# EAGLE design SpinningControls (EAGLE 9.5.2)

## Sheet 1 of 2
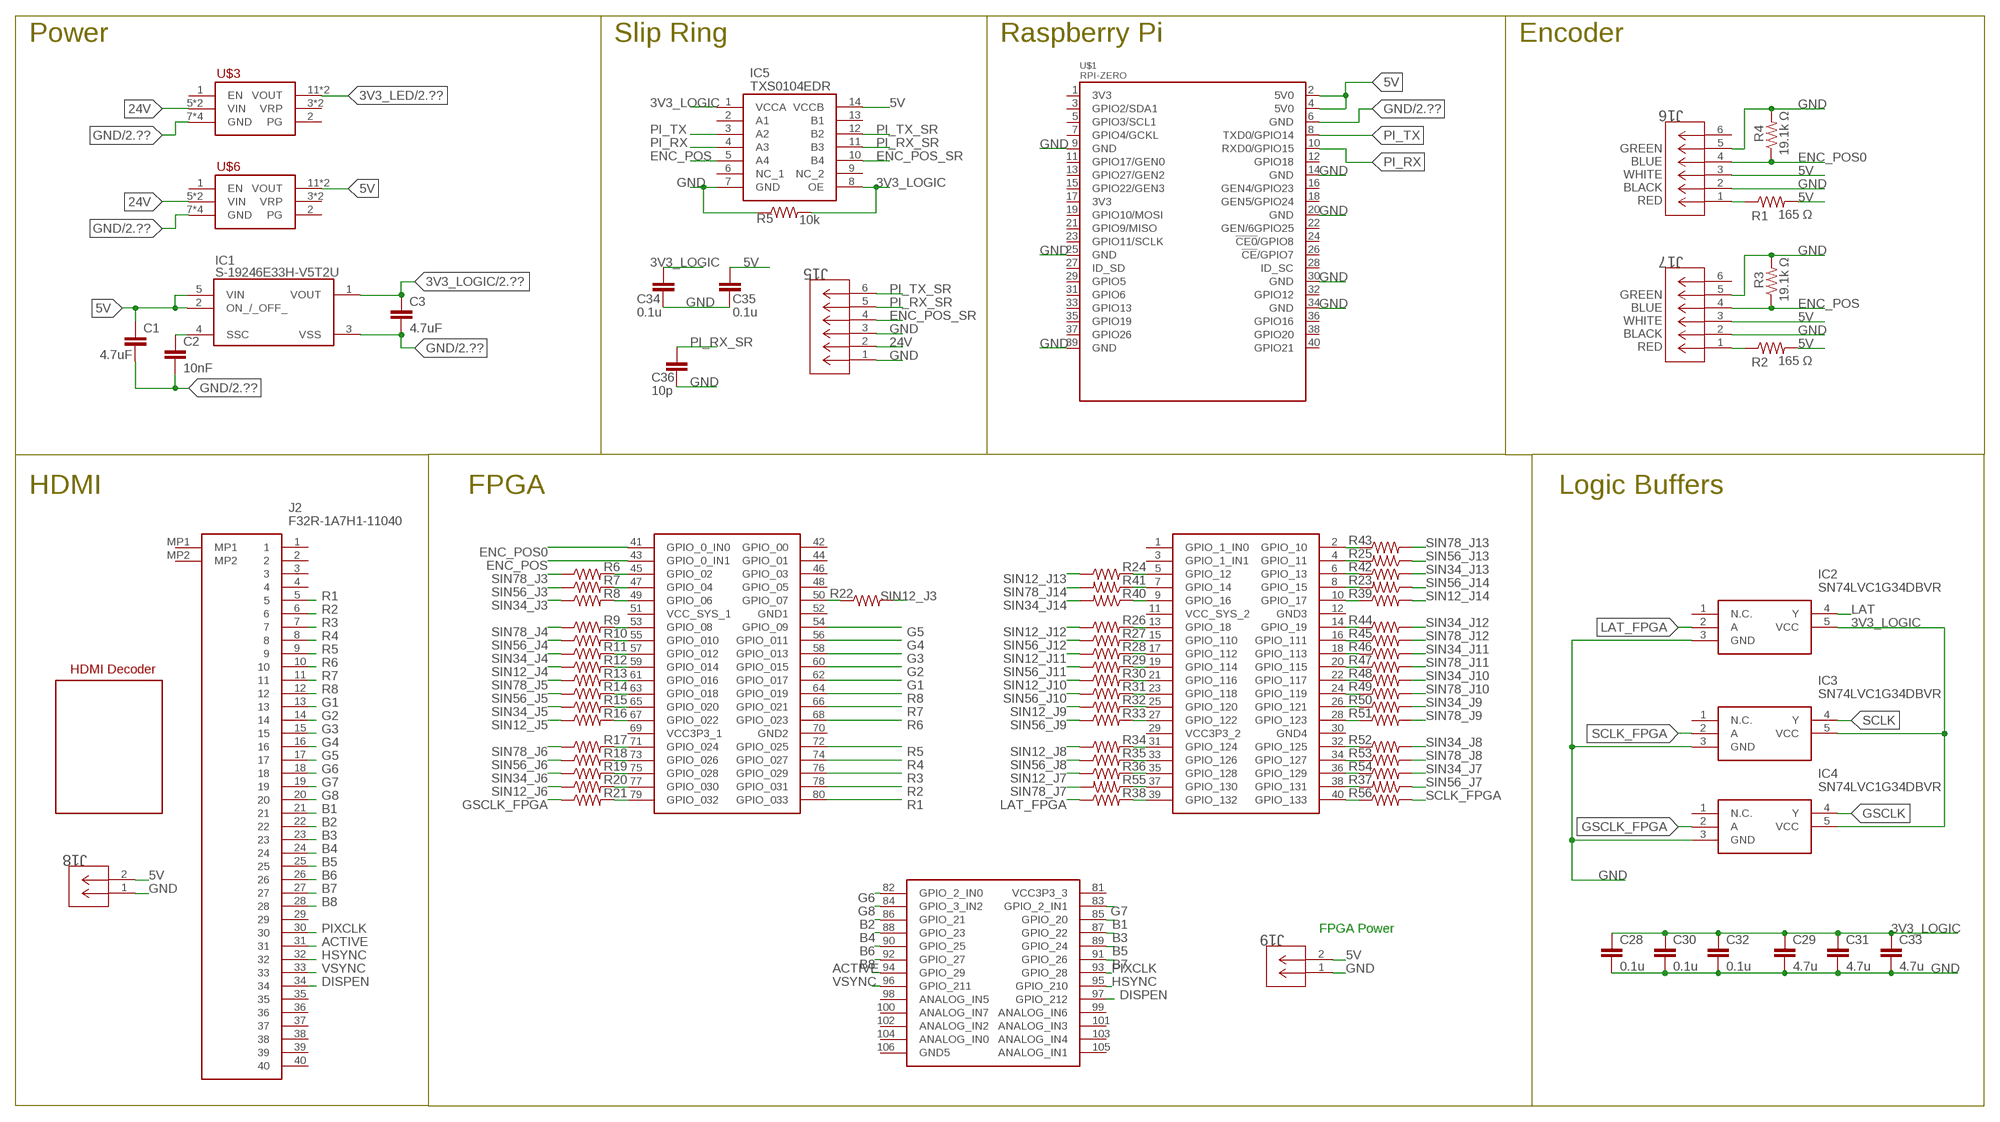
[diagram p0: schematic, sheet 1]

### Parts
C1  4.7uF  C-EUC0603  [C0603]
C2  10nF  C-EUC0603  [C0603]
C3  4.7uF  C-EUC0603  [C0603]
C28  0.1u  CAP_SMDC0603  [C0603]
C29  4.7u  CAP_SMDC0603  [C0603]
C30  0.1u  CAP_SMDC0603  [C0603]
C31  4.7u  CAP_SMDC0603  [C0603]
C32  0.1u  CAP_SMDC0603  [C0603]
C33  4.7u  CAP_SMDC0603  [C0603]
C34  0.1u  CAP_SMDC0603  [C0603]
C35  0.1u  CAP_SMDC0603  [C0603]
C36  10p  C-EUC0603  [C0603]
FPGA  DE0-NANO  [DE0-NANO]
IC1  S-19246E33H-V5T2U  [S19246E33HV5T2U]
IC2  SN74LVC1G34DBVR  [SOT95P280X145-5N]
IC3  SN74LVC1G34DBVR  [SOT95P280X145-5N]
IC4  SN74LVC1G34DBVR  [SOT95P280X145-5N]
IC5  TXS0104EDR  [SOIC127P600X175-14N]
J2  F32R-1A7H1-11040  [F32R1A7H111040]
J15  430450612  [CON_430450612_MOL]
J16  430450612  [CON_430450612_MOL]
J17  430450612  [CON_430450612_MOL]
J18  436500215  [CON_436500215_MOL]
J19  436500215  [CON_436500215_MOL]
R1  165 Ω  R-US_R0603  [R0603]
R2  165 Ω  R-US_R0603  [R0603]
R3  19.1k Ω  R-US_R0603  [R0603]
R4  19.1k Ω  R-US_R0603  [R0603]
R5  10k  R-US_R0603  [R0603]
R6  R-US_R0402  [R0402]
R7  R-US_R0402  [R0402]
R8  R-US_R0402  [R0402]
R9  R-US_R0402  [R0402]
R10  R-US_R0402  [R0402]
R11  R-US_R0402  [R0402]
R12  R-US_R0402  [R0402]
R13  R-US_R0402  [R0402]
R14  R-US_R0402  [R0402]
R15  R-US_R0402  [R0402]
R16  R-US_R0402  [R0402]
R17  R-US_R0402  [R0402]
R18  R-US_R0402  [R0402]
R19  R-US_R0402  [R0402]
R20  R-US_R0402  [R0402]
R21  R-US_R0402  [R0402]
R22  R-US_R0402  [R0402]
R23  R-US_R0402  [R0402]
R24  R-US_R0402  [R0402]
R25  R-US_R0402  [R0402]
R26  R-US_R0402  [R0402]
R27  R-US_R0402  [R0402]
R28  R-US_R0402  [R0402]
R29  R-US_R0402  [R0402]
R30  R-US_R0402  [R0402]
R31  R-US_R0402  [R0402]
R32  R-US_R0402  [R0402]
R33  R-US_R0402  [R0402]
R34  R-US_R0402  [R0402]
R35  R-US_R0402  [R0402]
R36  R-US_R0402  [R0402]
R37  R-US_R0402  [R0402]
R38  R-US_R0402  [R0402]
R39  R-US_R0402  [R0402]
R40  R-US_R0402  [R0402]
R41  R-US_R0402  [R0402]
R42  R-US_R0402  [R0402]
R43  R-US_R0402  [R0402]
R44  R-US_R0402  [R0402]
R45  R-US_R0402  [R0402]
R46  R-US_R0402  [R0402]
R47  R-US_R0402  [R0402]
R48  R-US_R0402  [R0402]
R49  R-US_R0402  [R0402]
R50  R-US_R0402  [R0402]
R51  R-US_R0402  [R0402]
R52  R-US_R0402  [R0402]
R53  R-US_R0402  [R0402]
R54  R-US_R0402  [R0402]
R55  R-US_R0402  [R0402]
R56  R-US_R0402  [R0402]
U$1  RPI-ZERO  [RASPBERRYPI_BASTELSTUBE_V13_RASPI_BOARD_B+_FULL]
U$2  TFP401  [TFP401]
U$3  3V3_BUCK_REGULATOR  [2X06]
U$6  5V_BUCK_REGULATOR  [2X06]

### Nets
3V3_LED: U$3.11(VOUT) U$3.12(VOUT) ; also sheet 2
3V3_LOGIC: C3.1 C28.1 C29.1 C30.1 C31.1 C32.1 C33.1 C34.1 IC1.1(VOUT) IC2.5(VCC) IC3.5(VCC) IC4.5(VCC) IC5.1(VCCA) IC5.8(OE) R5.2 ; also sheet 2
5V: C1.1 C35.1 IC1.2(ON_/_OFF_) IC1.5(VIN) IC5.14(VCCB) J16.3 J17.3 J18.2 J19.2 R1.2 R2.2 U$1.2(5V0) U$1.4(5V0) U$6.11(VOUT) U$6.12(VOUT)
24V: J15.2 U$3.5(VIN) U$3.6(VIN) U$6.5(VIN) U$6.6(VIN)
ACTIVE: FPGA.94(GPIO_29) J2.31
B1: FPGA.85(GPIO_20) J2.21
B2: FPGA.86(GPIO_21) J2.22
B3: FPGA.87(GPIO_22) J2.23
B4: FPGA.88(GPIO_23) J2.24
B5: FPGA.89(GPIO_24) J2.25
B6: FPGA.90(GPIO_25) J2.26
B7: FPGA.91(GPIO_26) J2.27
B8: FPGA.92(GPIO_27) J2.28
DISPEN: FPGA.97(GPIO_212) J2.34
ENC_POS: FPGA.43(GPIO_0_IN1) IC5.5(A4) J17.4 R3.1
ENC_POS0: FPGA.41(GPIO_0_IN0) J16.4 R4.1
ENC_POS_SR: IC5.10(B4) J15.4
G1: FPGA.62(GPIO_017) J2.13
G2: FPGA.60(GPIO_015) J2.14
G3: FPGA.58(GPIO_013) J2.15
G4: FPGA.56(GPIO_011) J2.16
G5: FPGA.54(GPIO_09) J2.17
G6: FPGA.82(GPIO_2_IN0) J2.18
G7: FPGA.83(GPIO_2_IN1) J2.19
G8: FPGA.84(GPIO_3_IN2) J2.20
GND: C1.2 C2.2 C3.2 C28.2 C29.2 C30.2 C31.2 C32.2 C33.2 C34.2 C35.2 C36.2 IC1.3(VSS) IC2.3(GND) IC3.3(GND) IC4.3(GND) IC5.7(GND) J15.1 J15.3 J16.2 J16.5 J17.2 J17.5 J18.1 J19.1 R3.2 R4.2 R5.1 U$1.6(GND) U$1.9(GND) U$1.14(GND) U$1.20(GND) U$1.25(GND) U$1.30(GND) U$1.34(GND) U$1.39(GND) U$3.7(GND) U$3.8(GND) U$3.9(GND) U$3.10(GND) U$6.7(GND) U$6.8(GND) U$6.9(GND) U$6.10(GND) ; also sheet 2
GSCLK: IC4.4(Y) ; also sheet 2
GSCLK_FPGA: IC4.2(A) R21.1
HSYNC: FPGA.95(GPIO_210) J2.32
LAT: IC2.4(Y) ; also sheet 2
LAT_FPGA: IC2.2(A) R38.1
N$1: J16.1 R1.1
N$2: FPGA.45(GPIO_02) R6.2
N$3: FPGA.50(GPIO_07) R22.1
N$4: C2.1 IC1.4(SSC)
N$5: FPGA.79(GPIO_032) R21.2
N$6: J17.1 R2.1
N$7: FPGA.8(GPIO_15) R23.2
N$8: FPGA.5(GPIO_12) R24.2
N$9: FPGA.4(GPIO_11) R25.2
N$10: FPGA.9(GPIO_16) R40.1
N$11: FPGA.7(GPIO_14) R41.1
N$12: FPGA.6(GPIO_13) R42.1
N$13: FPGA.2(GPIO_10) R43.1
N$14: FPGA.13(GPIO_18) R26.2
N$15: FPGA.47(GPIO_04) R7.2
N$16: FPGA.49(GPIO_06) R8.2
N$17: FPGA.15(GPIO_110) R27.2
N$18: FPGA.53(GPIO_08) R9.2
N$19: FPGA.55(GPIO_010) R10.2
N$20: FPGA.57(GPIO_012) R11.2
N$21: FPGA.59(GPIO_014) R12.2
N$22: FPGA.61(GPIO_016) R13.2
N$23: FPGA.63(GPIO_018) R14.2
N$24: FPGA.65(GPIO_020) R15.2
N$25: FPGA.67(GPIO_022) R16.2
N$26: FPGA.17(GPIO_112) R28.2
N$27: FPGA.71(GPIO_024) R17.2
N$28: FPGA.73(GPIO_026) R18.2
N$29: FPGA.75(GPIO_028) R19.2
N$30: FPGA.77(GPIO_030) R20.2
N$31: FPGA.19(GPIO_114) R29.2
N$32: FPGA.21(GPIO_116) R30.2
N$33: FPGA.23(GPIO_118) R31.2
N$34: FPGA.25(GPIO_120) R32.2
N$35: FPGA.27(GPIO_122) R33.2
N$36: FPGA.31(GPIO_124) R34.2
N$37: FPGA.33(GPIO_126) R35.2
N$38: FPGA.35(GPIO_128) R36.2
N$39: FPGA.38(GPIO_131) R37.2
N$40: FPGA.39(GPIO_132) R38.2
N$41: FPGA.14(GPIO_19) R44.1
N$42: FPGA.16(GPIO_111) R45.1
N$43: FPGA.18(GPIO_113) R46.1
N$44: FPGA.20(GPIO_115) R47.1
N$45: FPGA.22(GPIO_117) R48.1
N$46: FPGA.24(GPIO_119) R49.1
N$47: FPGA.26(GPIO_121) R50.1
N$48: FPGA.28(GPIO_123) R51.1
N$49: FPGA.32(GPIO_125) R52.1
N$50: FPGA.34(GPIO_127) R53.1
N$51: FPGA.36(GPIO_129) R54.1
N$52: FPGA.37(GPIO_130) R55.1
N$53: FPGA.40(GPIO_133) R56.1
N$54: FPGA.10(GPIO_17) R39.1
PI_RX: IC5.4(A3) U$1.10(RXD0/GPIO15)
PI_RX_SR: C36.1 IC5.11(B3) J15.5
PI_TX: IC5.3(A2) U$1.8(TXD0/GPIO14)
PI_TX_SR: IC5.12(B2) J15.6
PIXCLK: FPGA.93(GPIO_28) J2.30
R1: FPGA.80(GPIO_033) J2.5
R2: FPGA.78(GPIO_031) J2.6
R3: FPGA.76(GPIO_029) J2.7
R4: FPGA.74(GPIO_027) J2.8
R5: FPGA.72(GPIO_025) J2.9
R6: FPGA.68(GPIO_023) J2.10
R7: FPGA.66(GPIO_021) J2.11
R8: FPGA.64(GPIO_019) J2.12
SCLK: IC3.4(Y) ; also sheet 2
SCLK_FPGA: IC3.2(A) R56.2
SIN12_J3: R22.2 ; also sheet 2
SIN12_J4: R12.1 ; also sheet 2
SIN12_J5: R16.1 ; also sheet 2
SIN12_J6: R20.1 ; also sheet 2
SIN12_J7: R36.1 ; also sheet 2
SIN12_J8: R34.1 ; also sheet 2
SIN12_J9: R32.1 ; also sheet 2
SIN12_J10: R30.1 ; also sheet 2
SIN12_J11: R28.1 ; also sheet 2
SIN12_J12: R26.1 ; also sheet 2
SIN12_J13: R24.1 ; also sheet 2
SIN12_J14: R39.2 ; also sheet 2
SIN34_J3: R8.1 ; also sheet 2
SIN34_J4: R11.1 ; also sheet 2
SIN34_J5: R15.1 ; also sheet 2
SIN34_J6: R19.1 ; also sheet 2
SIN34_J7: R54.2 ; also sheet 2
SIN34_J8: R52.2 ; also sheet 2
SIN34_J9: R50.2 ; also sheet 2
SIN34_J10: R48.2 ; also sheet 2
SIN34_J11: R46.2 ; also sheet 2
SIN34_J12: R44.2 ; also sheet 2
SIN34_J13: R42.2 ; also sheet 2
SIN34_J14: R40.2 ; also sheet 2
SIN56_J3: R7.1 ; also sheet 2
SIN56_J4: R10.1 ; also sheet 2
SIN56_J5: R14.1 ; also sheet 2
SIN56_J6: R18.1 ; also sheet 2
SIN56_J7: R37.1 ; also sheet 2
SIN56_J8: R35.1 ; also sheet 2
SIN56_J9: R33.1 ; also sheet 2
SIN56_J10: R31.1 ; also sheet 2
SIN56_J11: R29.1 ; also sheet 2
SIN56_J12: R27.1 ; also sheet 2
SIN56_J13: R25.1 ; also sheet 2
SIN56_J14: R23.1 ; also sheet 2
SIN78_J3: R6.1 ; also sheet 2
SIN78_J4: R9.1 ; also sheet 2
SIN78_J5: R13.1 ; also sheet 2
SIN78_J6: R17.1 ; also sheet 2
SIN78_J7: R55.2 ; also sheet 2
SIN78_J8: R53.2 ; also sheet 2
SIN78_J9: R51.2 ; also sheet 2
SIN78_J10: R49.2 ; also sheet 2
SIN78_J11: R47.2 ; also sheet 2
SIN78_J12: R45.2 ; also sheet 2
SIN78_J13: R43.2 ; also sheet 2
SIN78_J14: R41.2 ; also sheet 2
VSYNC: FPGA.96(GPIO_211) J2.33
Unconnected: FPGA.1(GPIO_1_IN0) FPGA.3(GPIO_1_IN1) FPGA.11(VCC_SYS_2) FPGA.12(GND3) FPGA.29(VCC3P3_2) FPGA.30(GND4) FPGA.42(GPIO_00) FPGA.44(GPIO_01) FPGA.46(GPIO_03) FPGA.48(GPIO_05) FPGA.51(VCC_SYS_1) FPGA.52(GND1) FPGA.69(VCC3P3_1) FPGA.70(GND2) FPGA.81(VCC3P3_3) FPGA.98(ANALOG_IN5) FPGA.99(ANALOG_IN6) FPGA.100(ANALOG_IN7) FPGA.101(ANALOG_IN3) FPGA.102(ANALOG_IN2) FPGA.103(ANALOG_IN4) FPGA.104(ANALOG_IN0) FPGA.105(ANALOG_IN1) FPGA.106(GND5) IC2.1(N.C.) IC3.1(N.C.) IC4.1(N.C.) IC5.2(A1) IC5.6(NC_1) IC5.9(NC_2) IC5.13(B1) J2.1 J2.2 J2.3 J2.4 J2.29 J2.35 J2.36 J2.37 J2.38 J2.39 J2.40 J2.MP1 J2.MP2 J16.6 J17.6 U$1.1(3V3) U$1.3(GPIO2/SDA1) U$1.5(GPIO3/SCL1) U$1.7(GPIO4/GCKL) U$1.11(GPIO17/GEN0) U$1.12(GPIO18) U$1.13(GPIO27/GEN2) U$1.15(GPIO22/GEN3) U$1.16(GEN4/GPIO23) U$1.17(3V3) U$1.18(GEN5/GPIO24) U$1.19(GPIO10/MOSI) U$1.21(GPIO9/MISO) U$1.22(GEN/6GPIO25) U$1.23(GPIO11/SCLK) U$1.24(!CE0!/GPIO8) U$1.26(!CE!/GPIO7) U$1.27(ID_SD) U$1.28(ID_SC) U$1.29(GPIO5) U$1.31(GPIO6) U$1.32(GPIO12) U$1.33(GPIO13) U$1.35(GPIO19) U$1.36(GPIO16) U$1.37(GPIO26) U$1.38(GPIO20) U$1.40(GPIO21) U$3.1(EN) U$3.2(PG) U$3.3(VRP) U$3.4(VRP) U$6.1(EN) U$6.2(PG) U$6.3(VRP) U$6.4(VRP)

### Notes on the sheet
- Power | Slip Ring | Raspberry Pi | Encoder
- GREEN
  BLUE
  WHITE
  BLACK
  RED
- GREEN
  BLUE
  WHITE
  BLACK
  RED
- HDMI | FPGA | Logic Buffers
- FPGA Power

## Sheet 2 of 2
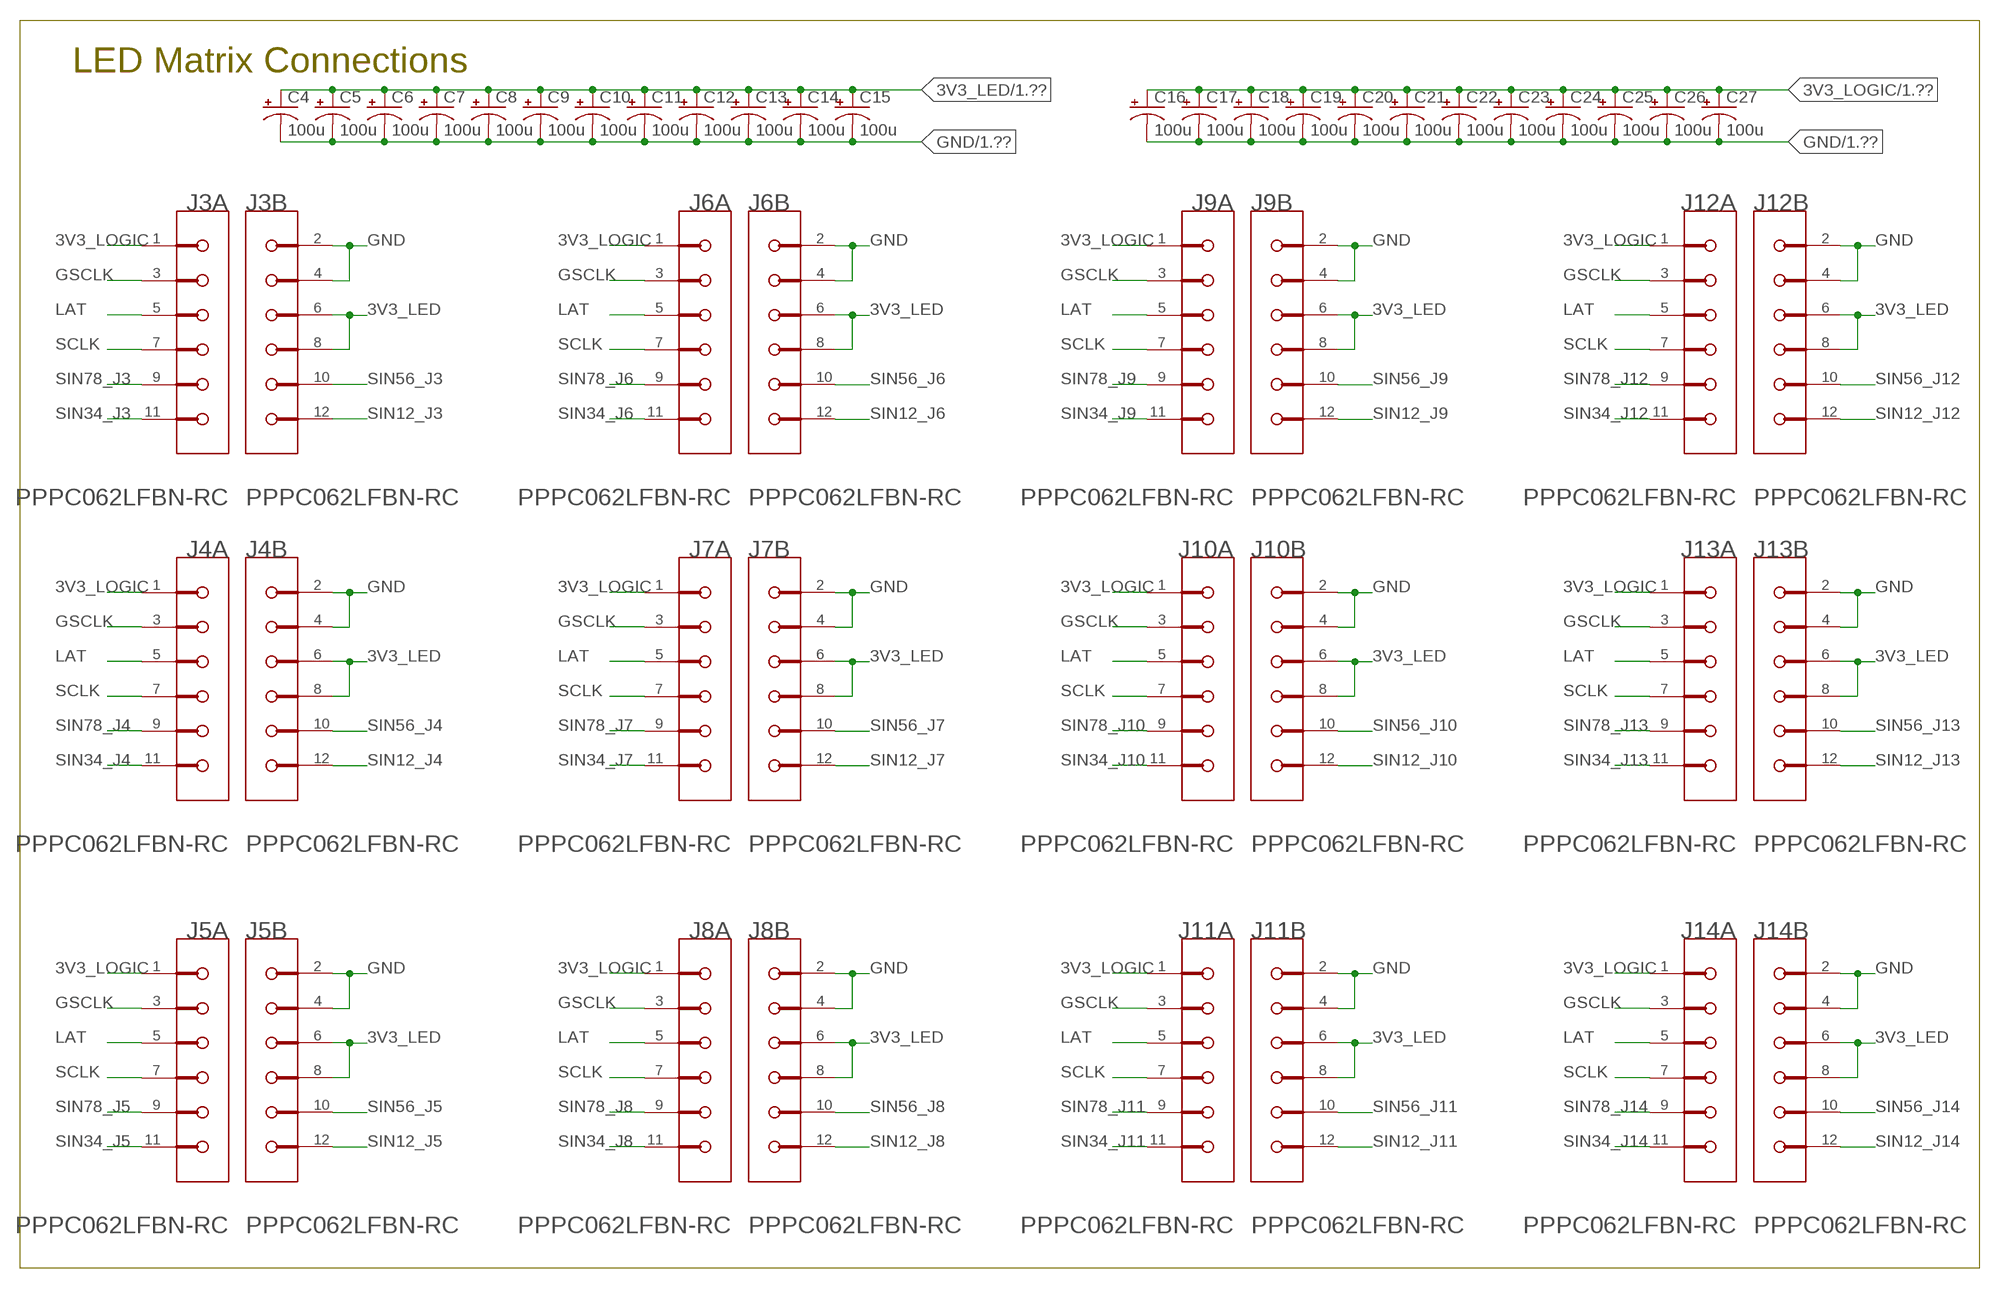
[diagram p1: schematic, sheet 2]

### Parts
C4  100u  CAP_THTE2-5  [E2-5]
C5  100u  CAP_THTE2-5  [E2-5]
C6  100u  CAP_THTE2-5  [E2-5]
C7  100u  CAP_THTE2-5  [E2-5]
C8  100u  CAP_THTE2-5  [E2-5]
C9  100u  CAP_THTE2-5  [E2-5]
C10  100u  CAP_THTE2-5  [E2-5]
C11  100u  CAP_THTE2-5  [E2-5]
C12  100u  CAP_THTE2-5  [E2-5]
C13  100u  CAP_THTE2-5  [E2-5]
C14  100u  CAP_THTE2-5  [E2-5]
C15  100u  CAP_THTE2-5  [E2-5]
C16  100u  CAP_THTE2-5  [E2-5]
C17  100u  CAP_THTE2-5  [E2-5]
C18  100u  CAP_THTE2-5  [E2-5]
C19  100u  CAP_THTE2-5  [E2-5]
C20  100u  CAP_THTE2-5  [E2-5]
C21  100u  CAP_THTE2-5  [E2-5]
C22  100u  CAP_THTE2-5  [E2-5]
C23  100u  CAP_THTE2-5  [E2-5]
C24  100u  CAP_THTE2-5  [E2-5]
C25  100u  CAP_THTE2-5  [E2-5]
C26  100u  CAP_THTE2-5  [E2-5]
C27  100u  CAP_THTE2-5  [E2-5]
J3  SULLINS_PPPC062LFBN-RCSULLINS_PPPC062LFBN-RC_0_0  [SULLINS_PPPC062LFBN-RC_0]
J4  SULLINS_PPPC062LFBN-RCSULLINS_PPPC062LFBN-RC_0_0  [SULLINS_PPPC062LFBN-RC_0]
J5  SULLINS_PPPC062LFBN-RCSULLINS_PPPC062LFBN-RC_0_0  [SULLINS_PPPC062LFBN-RC_0]
J6  SULLINS_PPPC062LFBN-RCSULLINS_PPPC062LFBN-RC_0_0  [SULLINS_PPPC062LFBN-RC_0]
J7  SULLINS_PPPC062LFBN-RCSULLINS_PPPC062LFBN-RC_0_0  [SULLINS_PPPC062LFBN-RC_0]
J8  SULLINS_PPPC062LFBN-RCSULLINS_PPPC062LFBN-RC_0_0  [SULLINS_PPPC062LFBN-RC_0]
J9  SULLINS_PPPC062LFBN-RCSULLINS_PPPC062LFBN-RC_0_0  [SULLINS_PPPC062LFBN-RC_0]
J10  SULLINS_PPPC062LFBN-RCSULLINS_PPPC062LFBN-RC_0_0  [SULLINS_PPPC062LFBN-RC_0]
J11  SULLINS_PPPC062LFBN-RCSULLINS_PPPC062LFBN-RC_0_0  [SULLINS_PPPC062LFBN-RC_0]
J12  SULLINS_PPPC062LFBN-RCSULLINS_PPPC062LFBN-RC_0_0  [SULLINS_PPPC062LFBN-RC_0]
J13  SULLINS_PPPC062LFBN-RCSULLINS_PPPC062LFBN-RC_0_0  [SULLINS_PPPC062LFBN-RC_0]
J14  SULLINS_PPPC062LFBN-RCSULLINS_PPPC062LFBN-RC_0_0  [SULLINS_PPPC062LFBN-RC_0]

### Nets
3V3_LED: C4.+ C5.+ C6.+ C7.+ C8.+ C9.+ C10.+ C11.+ C12.+ C13.+ C14.+ C15.+ J3.6 J3.8 J4.6 J4.8 J5.6 J5.8 J6.6 J6.8 J7.6 J7.8 J8.6 J8.8 J9.6 J9.8 J10.6 J10.8 J11.6 J11.8 J12.6 J12.8 J13.6 J13.8 J14.6 J14.8 ; also sheet 1
3V3_LOGIC: C16.+ C17.+ C18.+ C19.+ C20.+ C21.+ C22.+ C23.+ C24.+ C25.+ C26.+ C27.+ J3.1 J4.1 J5.1 J6.1 J7.1 J8.1 J9.1 J10.1 J11.1 J12.1 J13.1 J14.1 ; also sheet 1
GND: C4.- C5.- C6.- C7.- C8.- C9.- C10.- C11.- C12.- C13.- C14.- C15.- C16.- C17.- C18.- C19.- C20.- C21.- C22.- C23.- C24.- C25.- C26.- C27.- J3.2 J3.4 J4.2 J4.4 J5.2 J5.4 J6.2 J6.4 J7.2 J7.4 J8.2 J8.4 J9.2 J9.4 J10.2 J10.4 J11.2 J11.4 J12.2 J12.4 J13.2 J13.4 J14.2 J14.4 ; also sheet 1
GSCLK: J3.3 J4.3 J5.3 J6.3 J7.3 J8.3 J9.3 J10.3 J11.3 J12.3 J13.3 J14.3 ; also sheet 1
LAT: J3.5 J4.5 J5.5 J6.5 J7.5 J8.5 J9.5 J10.5 J11.5 J12.5 J13.5 J14.5 ; also sheet 1
SCLK: J3.7 J4.7 J5.7 J6.7 J7.7 J8.7 J9.7 J10.7 J11.7 J12.7 J13.7 J14.7 ; also sheet 1
SIN12_J3: J3.12 ; also sheet 1
SIN12_J4: J4.12 ; also sheet 1
SIN12_J5: J5.12 ; also sheet 1
SIN12_J6: J6.12 ; also sheet 1
SIN12_J7: J7.12 ; also sheet 1
SIN12_J8: J8.12 ; also sheet 1
SIN12_J9: J9.12 ; also sheet 1
SIN12_J10: J10.12 ; also sheet 1
SIN12_J11: J11.12 ; also sheet 1
SIN12_J12: J12.12 ; also sheet 1
SIN12_J13: J13.12 ; also sheet 1
SIN12_J14: J14.12 ; also sheet 1
SIN34_J3: J3.11 ; also sheet 1
SIN34_J4: J4.11 ; also sheet 1
SIN34_J5: J5.11 ; also sheet 1
SIN34_J6: J6.11 ; also sheet 1
SIN34_J7: J7.11 ; also sheet 1
SIN34_J8: J8.11 ; also sheet 1
SIN34_J9: J9.11 ; also sheet 1
SIN34_J10: J10.11 ; also sheet 1
SIN34_J11: J11.11 ; also sheet 1
SIN34_J12: J12.11 ; also sheet 1
SIN34_J13: J13.11 ; also sheet 1
SIN34_J14: J14.11 ; also sheet 1
SIN56_J3: J3.10 ; also sheet 1
SIN56_J4: J4.10 ; also sheet 1
SIN56_J5: J5.10 ; also sheet 1
SIN56_J6: J6.10 ; also sheet 1
SIN56_J7: J7.10 ; also sheet 1
SIN56_J8: J8.10 ; also sheet 1
SIN56_J9: J9.10 ; also sheet 1
SIN56_J10: J10.10 ; also sheet 1
SIN56_J11: J11.10 ; also sheet 1
SIN56_J12: J12.10 ; also sheet 1
SIN56_J13: J13.10 ; also sheet 1
SIN56_J14: J14.10 ; also sheet 1
SIN78_J3: J3.9 ; also sheet 1
SIN78_J4: J4.9 ; also sheet 1
SIN78_J5: J5.9 ; also sheet 1
SIN78_J6: J6.9 ; also sheet 1
SIN78_J7: J7.9 ; also sheet 1
SIN78_J8: J8.9 ; also sheet 1
SIN78_J9: J9.9 ; also sheet 1
SIN78_J10: J10.9 ; also sheet 1
SIN78_J11: J11.9 ; also sheet 1
SIN78_J12: J12.9 ; also sheet 1
SIN78_J13: J13.9 ; also sheet 1
SIN78_J14: J14.9 ; also sheet 1

### Notes on the sheet
- LED Matrix Connections

## Library data of the parts
C1-C3 C36 = rcl:C-EU: CAPACITOR, European symbol; SPICEPREFIX: C
C4-C27 = GTOR - Passive Components:CAP_THT: POLARIZED CAPACITOR, American symbol; SPICEPREFIX: C
C28-C35 = GTOR - Passive Components:CAP_SMD: CAPACITOR, European symbol; SPICEPREFIX: C
FPGA = VoxelEagleLib:DE0-NANO
IC1 = SamacSys_Parts:S-19246E33H-V5T2U: LDO Voltage Regulators IC REG LINEAR 2000MA 3.3V Source: Datasheet <https://www.ablic.com/en/doc/datasheet/automotive_voltage_regulator/S19246xxxH_E.pdf>; DESCRIPTION: LDO Voltage Regulators IC REG LINEAR 2000MA 3.3V; HEIGHT: 1.3mm; MANUFACTURER_NAME: ABLIC Inc.; MANUFACTURER_PART_NUMBER: S-19246E33H-V5T2U; MOUSER_PART_NUMBER: 628-S-19246E33HV5T2U; MOUSER_PRICE-STOCK: https://www.mouser.co.uk/ProductDetail/ABLIC/S-19246E33H-V5T2U?qs=DPoM0jnrROWX68Lwh%2F%252BJLQ%3D%3D
IC2-IC4 = SN74LVC1G34DBVR:SN74LVC1G34DBVR: Single Buffer Gate Source: Datasheet <http://www.ti.com/lit/gpn/sn74lvc1g34>; ARROW_PART_NUMBER: SN74LVC1G34DBVR; ARROW_PRICE-STOCK: https://www.arrow.com/en/products/sn74lvc1g34dbvr/texas-instruments?region=nac; DESCRIPTION: Single Buffer Gate; HEIGHT: 1.45mm; MANUFACTURER_NAME: Texas Instruments; MANUFACTURER_PART_NUMBER: SN74LVC1G34DBVR; MOUSER_PART_NUMBER: 595-SN74LVC1G34DBVR; MOUSER_PRICE-STOCK: https://www.mouser.co.uk/ProductDetail/Texas-Instruments/SN74LVC1G34DBVR?qs=dT9u2OTAaVXXjYSQb2wcdg%3D%3D
IC5 = TXS0104EDR:TXS0104EDR: 4-Bit Bidirectional Voltage-Level Shifter for Open-Drain and Push-Pull Applications Source: Datasheet <http://www.ti.com/lit/gpn/txs0104e>; ARROW_PART_NUMBER: TXS0104EDR; ARROW_PRICE-STOCK: https://www.arrow.com/en/products/txs0104edr/texas-instruments?region=nac; DESCRIPTION: 4-Bit Bidirectional Voltage-Level Shifter for Open-Drain and Push-Pull Applications; HEIGHT: 1.75mm; MANUFACTURER_NAME: Texas Instruments; MANUFACTURER_PART_NUMBER: TXS0104EDR; MOUSER_PART_NUMBER: 595-TXS0104EDR; MOUSER_PRICE-STOCK: https://www.mouser.co.uk/ProductDetail/Texas-Instruments/TXS0104EDR?qs=7kv20MEVUljeQYQBZTsYxg%3D%3D
J2 = F32R-1A7H1-11040:F32R-1A7H1-11040: FFC & FPC Connectors F32R-1A7H1-11040-Slider type Source: Datasheet <https://www.amphenol-icc.com/media/wysiwyg/files/documentation/datasheet/flex/ffc_fpc_050mm_f32r_f32q.pdf?__cf_chl_jschl_tk__=3f8f457df8d9f1b20a5b96c6726c259c8be1ce98-1619065013-0-AaW0kb0KQGEq_oHMA2XTFNl_vLi6zRgloyGJP8x-et_CNrU4YAnBmhGxtOwLCBLKfJ3m7u1QhbU>; DESCRIPTION: FFC & FPC Connectors F32R-1A7H1-11040-Slider type; HEIGHT: 2.8mm; MANUFACTURER_NAME: Amphenol ICC / Aorora; MANUFACTURER_PART_NUMBER: F32R-1A7H1-11040; MOUSER_PART_NUMBER: 649-F32R-1A7H1-11040; MOUSER_PRICE-STOCK: https://www.mouser.co.uk/ProductDetail/Amphenol-ICC-Aorora/F32R-1A7H1-11040?qs=xZ%2FP%252Ba9zWqZi2ltQqa0C7A%3D%3D
J3-J14 = Sullins - PPPC062LFBN-RC:SULLINS_PPPC062LFBN-RC: 12 Position Header Connector 0.100" (2.54mm) Through Hole Gold; AUTOMOTIVE: No; CENTROID_NOT_SPECIFIED: No; CONN_GENDER: Female; CONN_ORIENTATION: Straight; CONTACT_MATERIAL: Gold,Nickel; CURRENT_RATING: 3A; DATASHEET: https://drawings-pdf.s3.amazonaws.com/10492.pdf; DEVICE_CLASS_L1: Connectors; DEVICE_CLASS_L2: Headers and Wire Housings; DEVICE_CLASS_L3: unset; DIGIKEY_DESCRIPTION: CONN HDR 12POS 0.1 GOLD PCB; DIGIKEY_PART_NUMBER: S7109-ND; FOOTPRINT_VARIANT_NAME_0: Recommended_Land_Pattern; HEIGHT: 8.65mm; IS_FEMALE: yes; LEAD_FREE: Yes; MF: Sullins; MFG_PACKAGE_IDENT: 0; MFG_PACKAGE_IDENT_DATE: 0; MFG_PACKAGE_IDENT_REV: 0; MPN: PPPC062LFBN-RC; NUMBER_OF_CONTACTS: 12; NUMBER_OF_ROWS: 2; PACKAGE: CONN_12; PITCH: 2.54mm; PREFIX: J; ROHS: Yes; TEMPERATURE_RANGE_HIGH: +105°C; TEMPERATURE_RANGE_LOW: -40°C; VERIFICATION_VERSION: 0.0.0.3; VOLTAGE_RATING: 250V
J15-J17 = molex:430450612; COPYRIGHT: Copyright (C) 2022 Ultra Librarian. All rights reserved.; MANUFACTURER_PART_NUMBER: 430450612; MFR_NAME: Molex Connector Corporation
J18 J19 = molex:436500215; COPYRIGHT: Copyright (C) 2022 Ultra Librarian. All rights reserved.; DIGI-KEY_PART_NUMBER_1: WM1917-ND; MANUFACTURER_PART_NUMBER: 436500215; MFR_NAME: Molex Connector Corporation
R1-R56 = rcl:R-US_: RESISTOR, American symbol; SPICEPREFIX: R
U$1 = RPI-Zero:RPI-ZERO
U$2 = VoxelEagleLib:TFP401
U$3 = VoltageReg:3V3_BUCK_REGULATOR
U$6 = VoltageReg:5V_BUCK_REGULATOR

## Board
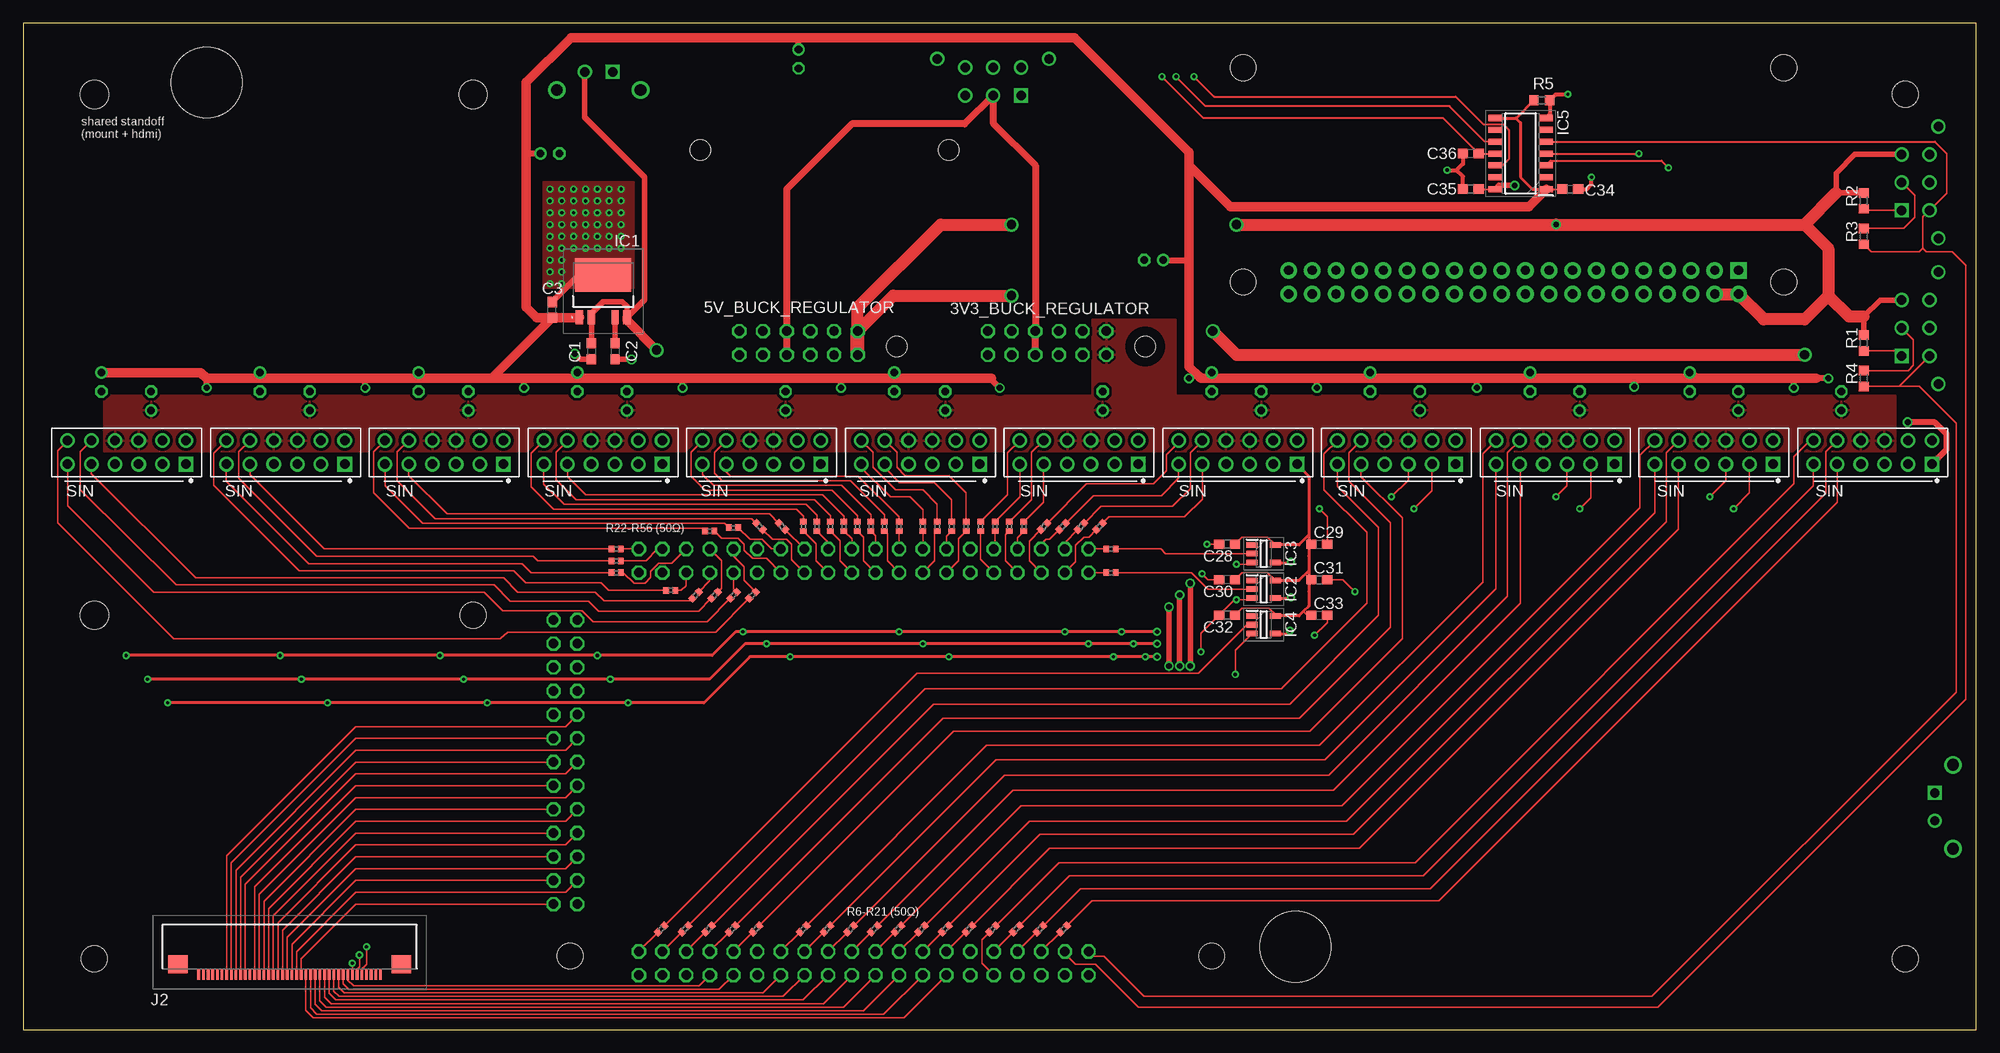
[diagram p2: board, top side]
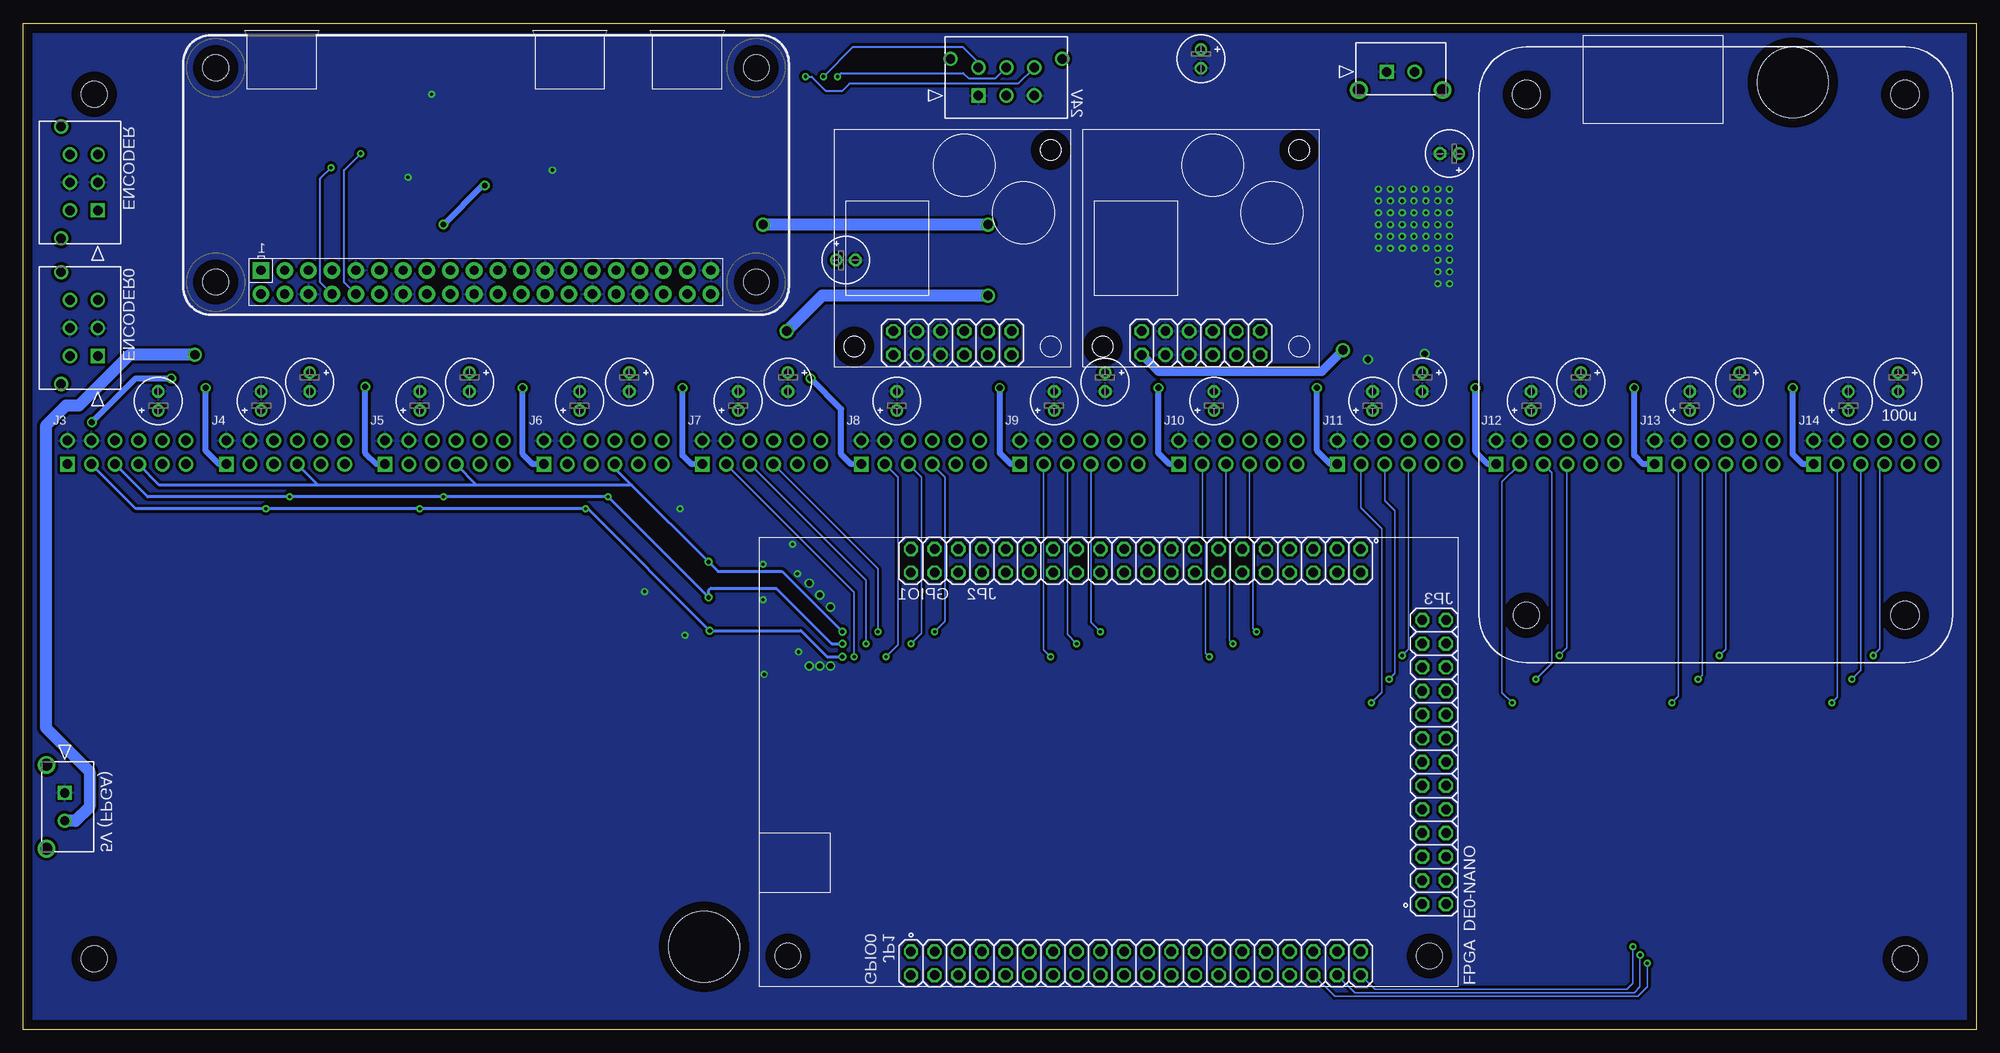
[diagram p3: board, bottom side, seen from below]

Size 209.55 x 107.95 mm. Coordinates in mm from the lower left corner, seen from the top.
Outline: 0,0 209.55,0 209.55,107.95 0,107.95 0,0
Copper layers (1*16): Top 0.035mm / dielectric 1.5mm / Bottom 0.035mm
Design rules "default": minimum track width 6mil, minimum drill 0.35mm, track to track 6mil, track to pad 6mil, pad to pad 6mil, via to via 6mil, smd to smd 6mil, copper to edge 40mil, drill to drill 6mil, minimum pad ring 10mil, minimum via ring 8mil, stop-mask expansion 4mil, vias tented up to drill 0mil, thermal gap 10mil
Holes 2.79 mm at 201.93,100.33 201.93,7.62 7.62,7.62
Holes 7.62 mm at 19.69,101.6 136.53,8.89

### Footprints (pad centres in the part's own frame; a part is rotated, then mirrored left to right if it is on the bottom)
C0603 = smd 1.1 x 1: 1 -0.85,0; 2 0.85,0
E2-5 = drill 0.813 pad 1.27: + -1.016,0 | drill 0.813 pad 1.27 octagon: - 1.016,0
DE0-NANO = drill 1.016 octagon: 1 -20.32,10.414; 2 -22.86,10.414; 3 -20.32,12.954; 4 -22.86,12.954; 5 -20.32,15.494; 6 -22.86,15.494; 7 -20.32,18.034; 8 -22.86,18.034; 9 -20.32,20.574; 10 -22.86,20.574; 11 -20.32,23.114; 12 -22.86,23.114; 13 -20.32,25.654; 14 -22.86,25.654; 15 -20.32,28.194; 16 -22.86,28.194; 17 -20.32,30.734; 18 -22.86,30.734; 19 -20.32,33.274; 20 -22.86,33.274; 21 -20.32,35.814; 22 -22.86,35.814; 23 -20.32,38.354; 24 -22.86,38.354; 25 -20.32,40.894; 26 -22.86,40.894; 27 -20.32,43.434; 28 -22.86,43.434; 29 -20.32,45.974; 30 -22.86,45.974; 31 -20.32,48.514; 32 -22.86,48.514; 33 -20.32,51.054; 34 -22.86,51.054; 35 -20.32,53.594; 36 -22.86,53.594; 37 -20.32,56.134; 38 -22.86,56.134; 39 -20.32,58.674; 40 -22.86,58.674; 41 20.32,58.674; 42 22.86,58.674; 43 20.32,56.134; 44 22.86,56.134; 45 20.32,53.594; 46 22.86,53.594; 47 20.32,51.054; 48 22.86,51.054; 49 20.32,48.514; 50 22.86,48.514; 51 20.32,45.974; 52 22.86,45.974; 53 20.32,43.434; 54 22.86,43.434; 55 20.32,40.894; 56 22.86,40.894; 57 20.32,38.354; 58 22.86,38.354; 59 20.32,35.814; 60 22.86,35.814; 61 20.32,33.274; 62 22.86,33.274; 63 20.32,30.734; 64 22.86,30.734; 65 20.32,28.194; 66 22.86,28.194; 67 20.32,25.654; 68 22.86,25.654; 69 20.32,23.114; 70 22.86,23.114; 71 20.32,20.574; 72 22.86,20.574; 73 20.32,18.034; 74 22.86,18.034; 75 20.32,15.494; 76 22.86,15.494; 77 20.32,12.954; 78 22.86,12.954; 79 20.32,10.414; 80 22.86,10.414; 81 15.24,3.81; 82 15.24,1.27; 83 12.7,3.81; 84 12.7,1.27; 85 10.16,3.81; 86 10.16,1.27; 87 7.62,3.81; 88 7.62,1.27; 89 5.08,3.81; 90 5.08,1.27; 91 2.54,3.81; 92 2.54,1.27; 93 0,3.81; 94 0,1.27; 95 -2.54,3.81; 96 -2.54,1.27; 97 -5.08,3.81; 98 -5.08,1.27; 99 -7.62,3.81; 100 -7.62,1.27; 101 -10.16,3.81; 102 -10.16,1.27; 103 -12.7,3.81; 104 -12.7,1.27; 105 -15.24,3.81; 106 -15.24,1.27 | hole 2.75: 20.828,3.048; 20.828,71.882
S19246E33HV5T2U = smd 0.8 x 1.5: 1 -2.54,-3.475; 2 -1.27,-3.475; 4 1.27,-3.475; 5 2.54,-3.475 | smd 6 x 3.6: 3 0,1.075
SOT95P280X145-5N = smd 1.2 x 0.6: 1 -1.25,0.95; 2 -1.25,0; 3 -1.25,-0.95; 4 1.25,-0.95; 5 1.25,0.95
SOIC127P600X175-14N = smd 1.525 x 0.65: 1 -2.712,3.81; 2 -2.712,2.54; 3 -2.712,1.27; 4 -2.712,0; 5 -2.712,-1.27; 6 -2.712,-2.54; 7 -2.712,-3.81; 8 2.712,-3.81; 9 2.712,-2.54; 10 2.712,-1.27; 11 2.712,0; 12 2.712,1.27; 13 2.712,2.54; 14 2.712,3.81
F32R1A7H111040 = smd 0.3 x 1.1: 1 -9.75,3; 2 -9.25,3; 3 -8.75,3; 4 -8.25,3; 5 -7.75,3; 6 -7.25,3; 7 -6.75,3; 8 -6.25,3; 9 -5.75,3; 10 -5.25,3; 11 -4.75,3; 12 -4.25,3; 13 -3.75,3; 14 -3.25,3; 15 -2.75,3; 16 -2.25,3; 17 -1.75,3; 18 -1.25,3; 19 -0.75,3; 20 -0.25,3; 21 0.25,3; 22 0.75,3; 23 1.25,3; 24 1.75,3; 25 2.25,3; 26 2.75,3; 27 3.25,3; 28 3.75,3; 29 4.25,3; 30 4.75,3; 31 5.25,3; 32 5.75,3; 33 6.25,3; 34 6.75,3; 35 7.25,3; 36 7.75,3; 37 8.25,3; 38 8.75,3; 39 9.25,3; 40 9.75,3 | smd 2.1 x 1.95: MP1 -12,1.875; MP2 12,1.875
SULLINS_PPPC062LFBN-RC_0 = drill 1.02 pad 1.57 square: 1 -6.35,-1.27 | drill 1.02 pad 1.57: 2 -6.35,1.27; 3 -3.81,-1.27; 4 -3.81,1.27; 5 -1.27,-1.27; 6 -1.27,1.27; 7 1.27,-1.27; 8 1.27,1.27; 9 3.81,-1.27; 10 3.81,1.27; 11 6.35,-1.27; 12 6.35,1.27
CON_430450612_MOL = drill 1.016 pad 1.524 square: 1 0,0 | drill 1.016 pad 1.524: 2 -2.997,0; 3 -5.994,0; 4 0,2.997; 5 -2.997,2.997; 6 -5.994,2.997 | drill 1.016 pad 1.016: M1 2.997,3.937; M2 -8.992,3.937
CON_436500215_MOL = drill 1.016 pad 1.524 square: 1 0,0 | drill 1.016 pad 1.524: 2 -2.997,0 | drill 1.27 pad 1.27: M1 2.997,-1.956; M2 -5.994,-1.956
R0603 = smd 1 x 1.1: 1 -0.85,0; 2 0.85,0
R0402 = smd 0.6 x 0.7: 1 -0.5,0; 2 0.5,0
RASPBERRYPI_BASTELSTUBE_V13_RASPI_BOARD_B+_FULL = drill 1 pad 1.778 square: 1 8.37,25.23 | drill 1 pad 1.778: 2 8.37,27.77; 3 10.91,25.23; 4 10.91,27.77; 5 13.45,25.23; 6 13.45,27.77; 7 15.99,25.23; 8 15.99,27.77; 9 18.53,25.23; 10 18.53,27.77; 11 21.07,25.23; 12 21.07,27.77; 13 23.61,25.23; 14 23.61,27.77; 15 26.15,25.23; 16 26.15,27.77; 17 28.69,25.23; 18 28.69,27.77; 19 31.23,25.23; 20 31.23,27.77; 21 33.77,25.23; 22 33.77,27.77; 23 36.31,25.23; 24 36.31,27.77; 25 38.85,25.23; 26 38.85,27.77; 27 41.39,25.23; 28 41.39,27.77; 29 43.93,25.23; 30 43.93,27.77; 31 46.47,25.23; 32 46.47,27.77; 33 49.01,25.23; 34 49.01,27.77; 35 51.55,25.23; 36 51.55,27.77; 37 54.09,25.23; 38 54.09,27.77; 39 56.63,25.23; 40 56.63,27.77 | hole 2.75: 3.5,3.5; 3.5,26.5; 61.5,3.5; 61.5,26.5
TFP401 = hole 3.048: 5.461,-5.207; 5.461,-45.847; 61.341,-45.847 | hole 2.794: 61.341,-5.207
2X06 = drill 1.016 octagon: 1 -6.35,1.27; 2 -6.35,3.81; 3 -3.81,1.27; 4 -3.81,3.81; 5 -1.27,1.27; 6 -1.27,3.81; 7 1.27,1.27; 8 1.27,3.81; 9 3.81,1.27; 10 3.81,3.81; 11 6.35,1.27; 12 6.35,3.81 | hole 2.2: 10.541,2.159; -10.541,23.241

### Placement (x,y rotation side)
C1  60.96,72.77 270 top
C2  63.5,72.77 270 top
C3  56.77,77.22 90 top
C4  195.07,67.44 90 bottom
C5  184.02,67.44 90 bottom
C6  167.01,67.44 90 bottom
C7  149.86,67.44 90 bottom
C8  132.84,67.44 90 bottom
C9  115.82,67.44 90 bottom
C10  98.93,67.44 90 bottom
C11  81.79,67.44 90 bottom
C12  64.77,67.44 90 bottom
C13  47.75,67.44 90 bottom
C14  30.73,67.44 90 bottom
C15  13.72,67.44 90 bottom
C16  178.82,69.47 270 bottom
C17  161.67,69.47 270 bottom
C18  144.53,69.47 270 bottom
C19  127.51,69.47 270 bottom
C20  93.47,69.47 270 bottom
C21  59.44,69.47 270 bottom
C22  42.42,69.47 270 bottom
C23  25.4,69.47 270 bottom
C24  8.38,69.47 270 bottom
C25  56.52,93.98 180 bottom
C26  83.19,104.14 270 bottom
C27  121.28,82.55 0 bottom
C28  129.16,52.07 180 top
C29  139.06,52.07 0 top
C30  129.16,48.26 180 top
C31  139.06,48.26 0 top
C32  129.16,44.45 180 top
C33  139.06,44.45 0 top
C34  165.99,90.17 0 top
C35  155.32,90.17 180 top
C36  155.32,93.98 180 top
FPGA  55.63,28.7 270 top
IC1  62.23,79.88 0 top
IC2  133.1,47.24 0 top
IC3  133.1,51.05 0 top
IC4  133.1,43.43 0 top
IC5  160.66,93.98 180 top
J2  28.57,8.89 180 top
J3  198.44,61.92 0 bottom
J4  181.41,61.92 0 bottom
J5  164.38,61.92 0 bottom
J6  147.35,61.92 0 bottom
J7  130.32,61.92 0 bottom
J8  113.29,61.92 0 bottom
J9  96.26,61.92 0 bottom
J10  79.23,61.92 0 bottom
J11  62.2,61.92 0 bottom
J12  45.17,61.92 0 bottom
J13  28.14,61.92 0 bottom
J14  11.11,61.92 0 bottom
J15  107.06,100.2 0 top
J16  201.55,72.26 270 top
J17  201.55,87.88 270 top
J18  63.25,102.74 0 top
J19  205.11,25.4 90 top
R1  197.49,73.66 90 top
R2  197.49,88.9 90 top
R3  197.49,85.09 90 top
R4  197.49,69.85 90 top
R5  162.94,99.69 180 top
R6  111.63,10.79 225 top
R7  109.09,10.79 225 top
R8  106.55,10.79 225 top
R9  101.47,10.79 225 top
R10  98.93,10.79 225 top
R11  96.39,10.79 225 top
R12  93.85,10.79 225 top
R13  91.31,10.79 225 top
R14  88.77,10.79 225 top
R15  86.23,10.79 225 top
R16  83.69,10.79 225 top
R17  78.61,10.79 225 top
R18  76.07,10.79 225 top
R19  73.53,10.79 225 top
R20  70.99,10.79 225 top
R21  68.45,10.79 225 top
R22  104.01,10.79 45 top
R23  74.17,46.61 45 top
R24  69.47,47.12 0 top
R25  63.63,50.29 0 top
R26  73.66,53.47 0 top
R27  78.99,53.98 315 top
R28  83.72,53.98 270 top
R29  86.61,53.98 270 top
R30  89.51,53.98 270 top
R31  92.41,53.98 270 top
R32  98.07,53.98 270 top
R33  101.17,53.98 270 top
R34  102.72,53.98 270 top
R35  105.82,53.98 270 top
R36  109.52,53.98 225 top
R37  113.49,53.98 225 top
R38  116.71,49.02 180 top
R39  78.23,46.61 225 top
R40  76.2,46.61 225 top
R41  72.14,46.61 225 top
R42  63.63,49.02 180 top
R43  63.63,51.56 180 top
R44  76.2,53.85 180 top
R45  81.41,53.98 135 top
R46  85.17,53.98 90 top
R47  88.06,53.98 90 top
R48  90.96,53.98 90 top
R49  93.98,53.98 90 top
R50  96.52,53.98 90 top
R51  99.62,53.98 90 top
R52  104.27,53.98 90 top
R53  107.37,53.98 90 top
R54  111.51,53.98 45 top
R55  115.47,53.98 45 top
R56  116.71,51.56 0 top
U$1  192.41,106.68 180 top
U$2  53.47,105.79 270 top
U$3  109.86,71.12 0 top
U$6  83.19,71.12 0 top

### Tracks (layer width: path | path; a pad name or v marks a point on that pad's centre or on a via)
3V3_LED
  pour Top (isolate 0.305): 8.64,61.98 11.43,61.98 200.91,61.98 200.91,68.07 9.91,68.07 8.64,68.07
  pour Top (isolate 0.305): 114.68,67.94 114.68,76.2 123.7,76.2 123.7,67.94
3V3_LOGIC  (via drill 0.65)
  Top 0.152: C28.1 130.77,52.83 133.52,52.83 IC3.5 | C30.1 130.77,49.02 133.52,49.02 IC2.5 | C32.1 130.77,45.21 133.67,45.21 134.49,44.38 | C33.1 137.8,44.45 137.37,44.87 | C29.1 137.94,51.8 137.94,50.8 | C31.1 137.94,47.98 137.94,46.99
  Top 0.203: IC5.1 163.45,90.17 C34.1 | 160.19,97.79 160.15,97.79
  Top 0.305: J7.1 137.94,59.38 137.94,53.06 | 137.94,53.06 136.89,52 IC3.5 | 137.94,53.06 137.94,50.8 137.94,49.25 | 137.94,49.25 136.89,48.19 IC2.5 | 137.94,49.25 137.94,46.99 137.94,45.44 137.37,44.87 136.89,44.38 134.49,44.38 IC4.5 | IC5.8 160.15,97.79 160.66,97.28 160.66,91.44 161.93,90.17 IC5.1 | R5.2 160.19,97.79
  Top 0.635: v189.99,68.83 189.99,69.72 190.12,69.85 | v202.18,65.15 205.11,65.15 206.38,63.88 206.38,62.23 J3.1 | v193.68,69.85 192.41,69.85 | v172.85,68.96 172.85,69.34 173.36,69.85 | v155.96,68.83 155.96,69.6 156.21,69.85 | v138.81,68.83 138.81,69.72 138.94,69.85 | v125.09,69.85 125.73,70.48 | v104.77,68.83 103.89,69.72 103.89,69.85 | v87.76,68.83 87.76,69.85 | v70.74,68.83 70.74,69.72 70.87,69.85 | v53.72,68.83 53.72,69.72 53.85,69.85 | v36.7,68.83 36.7,69.85 | v19.69,68.83 19.69,69.85 | C23.+ 26.04,69.85 | C22.+ 43.05,69.85 43.81,69.85 | C21.+ 60.07,69.85 60.32,69.85 | C20.+ 94.11,69.85 94.61,69.85 | C19.+ 128.14,69.85 128.91,69.85 | C18.+ 145.16,69.85 145.42,69.85 | C17.+ 161.93,70.23 161.93,69.85 | C16.+ 179.07,70.48 179.71,69.85 | C27.+ 125.09,82.55 | C26.+ 83.19,106.43 | C25.+ 53.97,93.98
  Top 1.016: IC1.1 59.65,76.37 C3.1 | C3.1 50.25,69.85 | 50.25,69.85 43.81,69.85 36.7,69.85 26.04,69.85 19.69,69.85 19.05,70.48 C24.+ | C3.1 55.08,76.37 53.97,77.47 53.97,93.98 53.97,101.6 58.8,106.43 83.19,106.43 112.78,106.43 125.09,94.11 125.09,92.71 | 125.09,92.71 125.09,82.55 125.09,71.12 125.73,70.48 126.36,69.85 128.91,69.85 138.94,69.85 145.42,69.85 156.21,69.85 161.93,69.85 173.36,69.85 179.71,69.85 190.12,69.85 192.41,69.85 | 103.89,69.85 94.61,69.85 87.76,69.85 70.87,69.85 60.32,69.85 53.85,69.85 50.25,69.85 | 125.09,92.71 129.54,88.27 161.54,88.27 163.45,90.17
  Bottom 0.635: J4.1 188.54,60.65 189.99,62.1 v189.99,68.83 | v202.18,65.15 197.49,69.85 v193.68,69.85 | J5.1 171.65,60.65 172.85,61.85 v172.85,68.96 | J6.1 154.88,60.65 155.96,61.72 v155.96,68.83 | J7.1 137.87,60.65 138.81,61.59 v138.81,68.83 | J8.1 120.72,60.65 121.79,61.72 121.79,66.55 v125.09,69.85 | J9.1 103.58,60.65 104.77,61.85 v104.77,68.83 | J10.1 86.56,60.65 87.76,61.85 v87.76,68.83 | J11.1 69.29,60.65 70.74,62.1 v70.74,68.83 | J12.1 52.39,60.65 53.72,61.98 v53.72,68.83 | J13.1 35.76,60.65 36.7,61.59 v36.7,68.83 | J14.1 18.61,60.65 19.69,61.72 v19.69,68.83
5V  (via drill 0.6, 1)
  Top 0.203: C35.1 IC5.14
  Top 0.61: C1.1 IC1.2 60.96,76.83 62.23,78.1 64.26,78.1 64.77,77.6 IC1.5 66.67,78.31 66.67,91.44 60.25,97.87 J18.2 | R2.2 194.53,89.75 194.53,91.87 196.53,93.88 J17.3 | J16.3 199.24,78.26 197.49,76.5 R1.2 | v160.02,90.55 158.32,90.55 IC5.14
  Top 1.016: v67.94,72.9 64.77,76.07 IC1.5
  Top 1.27: v106.05,86.36 98.42,86.36 89.53,77.47 U$6.12 93.34,78.74 v106.05,78.74 | v130.18,86.36 v164.47,86.36 191.14,86.36 | 191.14,86.36 193.68,83.82 193.68,78.74 | 193.68,78.74 191.14,76.2 186.75,76.2 U$1.2 U$1.4 | 191.14,86.36 194.53,89.75 | 193.68,78.74 195.91,76.5 197.49,76.5 | v127.63,74.93 130.18,72.39 v191.14,72.39
  Top 1.524: U$6.11 U$6.12
  Bottom 0.61: v160.02,90.55 160.27,90.55 v164.47,86.36
  Bottom 1.016: v67.94,72.9 70.23,70.61 87.76,70.61 U$6.11
  Bottom 1.27: v106.05,86.36 v130.18,86.36 | v106.05,78.74 123.83,78.74 v127.63,74.93 | v191.14,72.39 198.12,72.39 203.58,66.93 204.98,66.93 207.14,64.77 207.14,32.38 202.44,27.69 202.44,23.93 203.96,22.4 J19.2
24V
  Top 0.762: U$6.5 U$6.6 81.91,90.17 88.9,97.16 101.02,97.16 J15.2 104.06,97.23 108.58,92.71 U$3.6 U$3.5
ACTIVE
  Top 0.152: J2.31 23.32,16.34 35.69,28.7 FPGA.94
B1
  Top 0.152: J2.21 28.32,9.91 35.69,17.27 58.17,17.27 FPGA.85
B2
  Top 0.152: J2.22 27.82,10.68 35.69,18.54 FPGA.86
B3
  Top 0.152: J2.23 27.32,11.45 35.69,19.81 58.17,19.81 FPGA.87
B4
  Top 0.152: J2.24 26.82,12.22 35.69,21.08 FPGA.88
B5
  Top 0.152: J2.25 26.32,12.99 35.69,22.35 58.17,22.35 FPGA.89
B6
  Top 0.152: J2.26 25.82,13.76 35.69,23.62 FPGA.90
B7
  Top 0.152: J2.27 25.32,14.53 35.69,24.89 58.17,24.89 FPGA.91
B8
  Top 0.152: J2.28 24.82,15.3 35.69,26.16 FPGA.92
DISPEN
  Top 0.152: J2.34 21.82,18.65 35.69,32.51 58.17,32.51 FPGA.97
ENC_POS
  Top 0.152: 205.11,95.25 206.38,93.98 206.38,89.71 J17.4 203.84,87.17 203.84,83.82 | FPGA.43 111.76,8.13 112.9,6.98 115.06,6.98 119.63,2.41 175.39,2.41 208.41,35.43 208.41,81.99 206.96,83.44 204.22,83.44 203.84,83.82 | R3.1 198.29,83.44 203.45,83.44 203.84,83.82
  Top 0.203: IC5.5 205.11,95.25
ENC_POS0
  Top 0.152: J16.4 201.28,69 | 201.28,69 R4.1 | 201.28,69 203.42,69 207.39,65.02 207.39,36.2 174.75,3.56 120.27,3.56 115.95,7.87 114.81,7.87 FPGA.41
ENC_POS_SR  (via drill 0.35)
  Top 0.203: IC5.10 156.84,95.25 153.04,99.06 126.87,99.06 v123.7,102.23
  Bottom 0.203: J15.4 107.06,103.71 108.76,105.41 120.52,105.41 v123.7,102.23
G1
  Top 0.152: J2.13 32.32,3.49 33.02,2.79 85.85,2.79 FPGA.62
G2
  Top 0.152: J2.14 31.82,3.1 32.51,2.41 88.01,2.41 FPGA.60
G3
  Top 0.152: J2.15 31.32,2.71 32,2.03 90.17,2.03 FPGA.58
G4
  Top 0.152: J2.16 30.82,2.32 31.5,1.65 92.33,1.65 FPGA.56
G5
  Top 0.152: J2.17 30.32,2.06 31.12,1.27 94.49,1.27 FPGA.54
G6
  Top 0.152: J2.18 29.82,7.6 35.69,13.46 FPGA.82
G7
  Top 0.152: J2.19 29.32,8.37 35.69,14.73 58.17,14.73 FPGA.83
G8
  Top 0.152: J2.20 28.82,9.14 35.69,16 FPGA.84
GND  (via drill 0.35, 0.6, 0.65)
  Top 0.152: J17.2 202.95,89.48 202.95,87.12 201.76,85.94 R3.2 | J16.2 202.82,73.99 202.82,71.25 202.27,70.7 R4.2 | IC3.3 131.65,49.91 v130.18,49.91 | IC2.3 131.65,46.1 v130.18,46.1 129.96,46.1 C32.2 126.36,42.51 v126.36,40.51 | IC4.3 130.05,40.69 v130.05,38.1 | C28.2 v127,52.07 | C30.2 127.13,48.26 v126.49,48.9 | C29.2 139.92,55.03 v139.06,55.88 | C31.2 141.61,48.26 v142.88,46.99 | C33.2 139.92,43.65 v138.56,42.29
  Top 0.406: C36.2 154.47,92.88 153.8,92.2 | C35.2 154.47,91.53 153.8,92.2 | v152.78,92.2 153.8,92.2 | C34.2 167.77,90.17 168.28,90.68 v168.28,91.44 | v165.74,100.33 164.43,100.33 R5.1 163.79,98.21 IC5.7
  Top 0.61: C3.2 59.66,80.96 IC1.3 | C1.2 59.78,71.92 v59.18,72.52 | C2.2 65.24,71.92 v65.28,71.88 | v122.94,45.34 v122.94,38.99 | v124.08,38.99 v124.08,46.61 | v125.22,47.88 v125.22,38.99
  other vias: 56.52,90.17 57.78,90.17 59.05,90.17 60.32,90.17 61.59,90.17 62.86,90.17 64.14,90.17 64.14,88.9 62.86,88.9 61.59,88.9 60.32,88.9 59.05,88.9 57.78,88.9 56.52,88.9 56.52,87.63 57.78,87.63 59.05,87.63 60.32,87.63 61.59,87.63 62.86,87.63 64.14,87.63 64.14,86.36 62.86,86.36 61.59,86.36 60.32,86.36 59.05,86.36 57.78,86.36 56.52,86.36 56.52,85.09 57.78,85.09 59.05,85.09 60.32,85.09 61.59,85.09 62.86,85.09 64.14,85.09 64.14,83.82 62.86,83.82 61.59,83.82 60.32,83.82 59.05,83.82 57.78,83.82 56.52,83.82 56.52,82.55 57.78,82.55 57.78,81.28 56.52,81.28 56.52,80.01 57.78,80.01
  pour Bottom (isolate 0.305): -1.91,109.22 -1.91,-1.27 210.19,-1.27 210.19,109.22
  pour Top (no thermals): 55.75,79.5 55.75,90.93 65.53,90.93 65.53,79.5
GSCLK  (via drill 0.35, 0.45)
  Top 0.152: J6.3 151.16,57.82 v149.23,55.88 | J5.3 168.19,57.07 v167.01,55.88 | J4.3 185.22,57.59 v183.52,55.88
  Top 0.305: IC4.4 135.58,42.48 v135.89,42.8 | v121.67,40.01 v120.4,40.01 v116.97,40.01 v99.31,40.01 v82.3,40.01 77.98,40.01 73.02,35.05 v64.9,35.05 v49.78,35.05 v32.64,35.05 v15.49,35.05
  Bottom 0.152: J14.3 14.92,35.63 v15.49,35.05 | J12.3 50.88,58.75 50.88,36.15 v49.78,35.05 | J11.3 66.01,55.98 63.75,53.72 63.75,36.2 v64.9,35.05 | v82.3,40.01 82.68,40.39 82.68,52.32 83.04,52.69 J10.3 | J9.3 100.07,40.76 v99.31,40.01 | J8.3 115.7,59.25 115.7,41.27 v116.97,40.01 | J7.3 120.4,46.92 v120.4,40.01 | v32.64,35.05 31.95,35.74 J13.3
  Bottom 0.305: v121.67,40.01 123.32,40.01 126.11,42.8 v135.89,42.8 148.97,55.88 v149.23,55.88 v167.01,55.88 v183.52,55.88 197.48,55.88 J3.3
GSCLK_FPGA
  Top 0.152: IC4.2 131.32,43.43 126.11,38.23 95.88,38.23 R21.1
HSYNC
  Top 0.152: J2.32 22.82,17.11 35.69,29.97 58.17,29.97 FPGA.95
LAT  (via drill 0.35, 0.45)
  Top 0.152: J6.5 148.62,58.96 v146.81,57.15 | J5.5 165.65,58.34 v164.47,57.15 | J4.5 182.68,58.86 v180.98,57.15
  Top 0.305: IC2.4 135.96,46.29 v136.02,46.36 | v121.67,41.4 v119.13,41.4 v114.3,41.4 v96.52,41.4 v79.76,41.4 77.47,41.4 73.66,37.59 v62.99,37.59 v47.24,37.59 v29.85,37.59 v13.34,37.59
  Bottom 0.152: J14.5 12.38,38.55 v13.34,37.59 | J13.5 29.41,38.03 v29.85,37.59 | J12.5 45.55,59.76 45.55,39.29 v47.24,37.59 | J11.5 63.47,56.71 62.36,55.63 62.36,38.23 v62.99,37.59 | J10.5 80.5,52.69 80.14,52.32 80.14,41.78 v79.76,41.4 | v96.52,41.4 97.53,42.41 J9.5 | v114.3,41.4 113.16,42.54 113.16,59.25 J8.5 | J7.5 119.13,48.19 v119.13,41.4
  Bottom 0.305: v121.67,41.4 122.81,41.4 128.78,47.37 135.76,47.37 136.02,47.12 v136.02,46.36 v146.81,57.15 v164.47,57.15 v180.98,57.15 196.21,57.15 J3.5
LAT_FPGA
  Top 0.152: IC2.2 127.13,47.24 125.35,49.02 R38.1
N$1
  Top 0.152: R1.1 201,72.81 J16.1
N$2
  Top 0.152: FPGA.45 R6.2
N$3
  Top 0.152: R22.1 102.87,9.65 102.87,7.11 FPGA.50
N$4
  Top 0.61: IC1.4 C2.1
N$5
  Top 0.152: FPGA.79 R21.2
N$6
  Top 0.152: J17.1 197.65,87.88 R2.1
N$7
  Top 0.152: FPGA.8 74.93,50.29 74.93,47.37 R23.2
N$8
  Top 0.152: FPGA.5 71.12,47.63 70.6,47.12 R24.2
N$9
  Top 0.152: FPGA.4 68.07,51.56 66.8,50.29 R25.2
N$10
  Top 0.152: R40.1 76.2,47.32 FPGA.9
N$11
  Top 0.152: FPGA.7 73.66,48.13 R41.1
N$12
  Top 0.152: FPGA.6 69.57,50.01 68.17,50.01 67.33,49.18 67.33,48.51 66.7,47.88 65.52,47.88 64.38,49.02 R42.1
N$13
  Top 0.152: FPGA.2 R43.1
N$14
  Top 0.152: FPGA.13 79.76,50.55 78.23,50.55 77.34,51.44 77.34,52.07 76.71,52.7 74.92,52.7 R26.2
N$15
  Top 0.152: R7.2 FPGA.47
N$16
  Top 0.152: FPGA.49 R8.2
N$17
  Top 0.152: FPGA.15 82.42,50.42 82.42,52.07 81.91,52.58 80.39,52.58 R27.2
N$18
  Top 0.152: FPGA.53 R9.2
N$19
  Top 0.152: R10.2 FPGA.55
N$20
  Top 0.152: R11.2 FPGA.57
N$21
  Top 0.152: FPGA.59 R12.2
N$22
  Top 0.152: FPGA.61 R13.2
N$23
  Top 0.152: FPGA.63 R14.2
N$24
  Top 0.152: FPGA.65 R15.2
N$25
  Top 0.152: FPGA.67 R16.2
N$26
  Top 0.152: R28.2 85.09,52.1 85.09,50.29 FPGA.17
N$27
  Top 0.152: FPGA.71 R17.2
N$28
  Top 0.152: FPGA.73 R18.2
N$29
  Top 0.152: FPGA.75 R19.2
N$30
  Top 0.152: FPGA.77 R20.2
N$31
  Top 0.152: R29.2 87.63,52.46 87.63,50.29 FPGA.19
N$32
  Top 0.152: R30.2 90.17,52.82 90.17,50.29 FPGA.21
N$33
  Top 0.152: R31.2 92.71,53.17 92.71,50.29 FPGA.23
N$34
  Top 0.152: FPGA.25 97.79,50.29 97.79,53.2 R32.2
N$35
  Top 0.152: FPGA.27 100.33,50.29 100.33,52.64 R33.2
N$36
  Top 0.152: R34.2 102.72,50.44 FPGA.31
N$37
  Top 0.152: R35.2 105.41,53.07 105.41,50.29 FPGA.33
N$38
  Top 0.152: R36.2 107.95,52.4 107.95,50.29 FPGA.35
N$39
  Top 0.152: FPGA.38 111.76,52.25 R37.2
N$40
  Top 0.152: R38.2 FPGA.39
N$41
  Top 0.152: FPGA.14 80.26,51.56 79.25,52.58 77.97,52.58 R44.1
N$42
  Top 0.152: R45.1 FPGA.16 | FPGA.16
N$43
  Top 0.152: R46.1 86.36,52.28 FPGA.18
N$44
  Top 0.152: R47.1 88.9,52.64 FPGA.20
N$45
  Top 0.152: R48.1 91.44,52.99 FPGA.22
N$46
  Top 0.152: R49.1 FPGA.24
N$47
  Top 0.152: FPGA.26 R50.1
N$48
  Top 0.152: FPGA.28 99.06,52.92 R51.1
N$49
  Top 0.152: FPGA.32 104.27,51.69 R52.1
N$50
  Top 0.152: FPGA.34 106.68,52.79 R53.1
N$51
  Top 0.152: FPGA.36 109.22,52.07 109.73,52.58 110.11,52.58 R54.1
N$52
  Top 0.152: FPGA.37 112.9,50.16 112.9,51.94 113.79,52.83 114.33,52.83 R55.1
N$53
  Top 0.152: FPGA.40 R56.1
N$54
  Top 0.152: FPGA.10 76.2,50.8 77.34,49.66 77.34,48.2 R39.1
PI_RX  (via drill 0.35)
  Top 0.203: IC5.4 v173.36,93.98
  Bottom 0.203: U$1.10 175.13,80.17 175.13,92.2 v173.36,93.98
PI_RX_SR  (via drill 0.35)
  Top 0.203: IC5.11 C36.1 152.36,97.79 126.62,97.79 v122.17,102.23
  Bottom 0.203: J15.5 105.21,102.06 108.15,102.06 108.71,102.62 121.79,102.62 v122.17,102.23
PI_TX  (via drill 0.35)
  Top 0.203: IC5.3 163.88,93.22 175.77,93.22 v176.53,92.46
  Bottom 0.203: U$1.8 177.67,80.17 177.67,91.31 v176.53,92.46
PI_TX_SR  (via drill 0.35)
  Top 0.203: IC5.12 158.76,92.71 159.39,93.34 159.39,96.52 158.96,96.95 158.81,97.1 156.68,97.1 153.7,100.08 127.76,100.08 v125.6,102.23
  Bottom 0.203: v125.6,102.23 124.97,102.23 123.44,100.71 121.67,100.71 120.9,101.47 102.79,101.47 J15.6
PIXCLK
  Top 0.152: J2.30 23.82,15.57 35.69,27.43 58.17,27.43 FPGA.93
R1  (via drill 0.35)
  Top 0.152: J2.5 36.32,6.48 36.83,6.98 v36.83,8.89
  Bottom 0.152: v36.83,8.89 36.83,4.95 37.46,4.32 64.52,4.32 FPGA.80
R2  (via drill 0.35)
  Top 0.152: J2.6 35.82,6.49 36.07,6.73 v36.07,8
  Bottom 0.152: v36.07,8 36.07,4.57 36.7,3.94 66.67,3.94 FPGA.78
R3  (via drill 0.35)
  Top 0.152: J2.7 35.32,6.97 35.31,6.98 v35.31,7.11
  Bottom 0.152: v35.31,7.11 35.31,4.57 36.32,3.56 68.83,3.56 FPGA.76
R4
  Top 0.152: J2.8 34.82,5.31 35.43,4.7 72.52,4.7 FPGA.74
R5
  Top 0.152: J2.9 34.32,4.92 34.92,4.32 74.68,4.32 FPGA.72
R6
  Top 0.152: J2.10 33.82,4.53 34.42,3.94 79.38,3.94 FPGA.68
R7
  Top 0.152: J2.11 33.32,4.14 33.91,3.56 81.53,3.56 FPGA.66
R8
  Top 0.152: J2.12 32.82,3.88 33.53,3.17 83.69,3.17 FPGA.64
SCLK  (via drill 0.35, 0.45)
  Top 0.305: IC3.4 135.96,50.1 v136.02,50.16 | v121.67,42.67 v117.86,42.67 v111.76,42.67 v93.98,42.67 v77.22,42.67 76.45,42.67 73.91,40.13 v61.59,40.13 v44.7,40.13 v27.56,40.13 v11.05,40.13
  Bottom 0.152: J14.7 10.35,60.14 10.35,40.83 v11.05,40.13 | J13.7 26.87,40.82 v27.56,40.13 | J12.7 43.9,40.94 v44.7,40.13 | J10.7 77.96,52.69 77.6,52.32 77.6,43.05 v77.22,42.67 | J9.7 95,43.69 v93.98,42.67 | v111.76,42.67 110.62,43.81 110.62,59.25 J8.7 | J7.7 117.86,49.46 v117.86,42.67 | v61.59,40.13 60.93,40.8 J11.7
  Bottom 0.305: v121.67,42.67 128.14,49.15 135,49.15 v136.02,50.16 144.27,58.42 | J3.7 194.94,58.42 177.91,58.42 | 144.27,58.42 160.88,58.42 | 160.88,58.42 177.91,58.42 | 144.27,58.42 146.08,60.23 J6.7 | J5.7 160.88,58.42 | J4.7 177.91,58.42
SCLK_FPGA
  Top 0.152: IC3.2 122.55,51.05 122.05,51.56 R56.2
SIN12_J3
  Top 0.152: J3.12 191.71,63.19 189.99,61.47 189.99,58.55 149.35,17.91 111.12,17.91 R22.2
SIN12_J4
  Top 0.152: J4.12 173.48,61.61 173.48,56.01 141.48,24 107.06,24 R12.1
SIN12_J5
  Top 0.152: J5.12 156.59,61.75 156.59,48.01 139.06,30.48 103.38,30.48 R16.1
SIN12_J6
  Top 0.152: J6.12 139.57,61.76 139.57,57.91 144.15,53.34 144.15,45.72 135,36.58 96.77,36.58 R20.1
SIN12_J7
  Top 0.152: J7.12 123.97,62.94 122.68,61.65 122.68,59.94 121.28,58.55 114.1,58.55 R36.1
SIN12_J8
  Top 0.152: J8.12 105.63,61.88 105.63,57.39 R34.1
SIN12_J9
  Top 0.152: J9.12 91.19,61.91 91.19,60.33 93.6,57.91 96.54,57.91 98.07,56.38 R32.1
SIN12_J10
  Top 0.152: J10.12 71.63,61.94 71.63,59.38 73.15,57.86 86.79,57.86 89.51,55.14 R30.1
SIN12_J11
  Top 0.152: J11.12 54.48,61.82 54.48,58.24 56.9,55.83 82.98,55.83 83.72,55.09 R28.1
SIN12_J12
  Top 0.152: J12.12 37.59,61.96 37.59,57.61 41.4,53.8 72.83,53.8 R26.1
SIN12_J13
  Top 0.152: J13.12 20.45,61.85 20.45,58.37 29.62,49.23 52.6,49.23 53.87,47.93 61.98,47.93 62.79,47.12 R24.1
SIN12_J14
  Top 0.152: J14.12 3.68,62.11 3.68,54.36 16.13,41.91 51.18,41.91 51.94,42.65 74.27,42.65 R39.2
SIN34_J3
  Top 0.152: J3.11 192.09,58.36 150.24,16.51 112.27,16.51 R8.1
SIN34_J4
  Top 0.152: J4.11 175.06,55.44 141.97,22.35 107.95,22.35 R11.1
SIN34_J5
  Top 0.152: J5.11 158.03,47.32 139.67,28.96 104.39,28.96 R15.1
SIN34_J6
  Top 0.152: J6.11 141,58.29 145.42,53.88 145.42,44.45 135.89,34.92 97.66,34.92 R19.1
SIN34_J7
  Top 0.152: J7.11 123.97,59.13 122.12,57.28 114.81,57.28 R54.2
SIN34_J8
  Top 0.152: J8.11 106.93,57.14 R52.2
SIN34_J9
  Top 0.152: J9.11 89.91,60.27 93.03,57.15 95.12,57.15 96.52,55.75 R50.2
SIN34_J10
  Top 0.152: J10.11 72.88,59.53 74.04,58.37 87.81,58.37 90.96,55.22 R48.2
SIN34_J11
  Top 0.152: J11.11 55.85,58.53 58.04,56.34 84,56.34 85.17,55.17 R46.2
SIN34_J12
  Top 0.152: R44.2 75.24,54.3 42.85,54.3 38.82,58.34 J12.11
SIN34_J13
  Top 0.152: J13.11 21.79,58.8 30.61,49.99 53.52,49.99 54.48,49.02 R42.2
SIN34_J14
  Top 0.152: J14.11 4.76,56.2 14,46.94 49.42,46.94 51.43,44.96 59.94,44.96 61.14,43.76 73.36,43.76 R40.2
SIN56_J3
  Top 0.152: J3.10 193.42,61.98 193.42,57.53 151,15.11 113.41,15.11 R7.1
SIN56_J4
  Top 0.152: J4.10 176.28,61.87 176.28,54.48 142.75,20.95 109.09,20.95 R10.1
SIN56_J5
  Top 0.152: J5.10 159.26,61.88 159.26,46.48 140.08,27.3 105.28,27.3 R14.1
SIN56_J6
  Top 0.152: J6.10 142.24,61.89 142.24,58.8 146.69,54.36 146.69,43.18 136.91,33.4 98.68,33.4 R18.1
SIN56_J7
  Top 0.152: J7.10 125.22,61.9 125.22,58.04 123.32,56.13 115.65,56.13 R37.1
SIN56_J8
  Top 0.152: J8.10 108.2,61.91 108.2,58.42 108.2,56.86 R35.1
SIN56_J9
  Top 0.152: J9.10 93.73,61.91 93.73,60.33 94.61,59.44 99.31,59.44 101.17,57.58 R33.1
SIN56_J10
  Top 0.152: J10.10 74.17,61.94 74.17,59.69 74.98,58.88 88.77,58.88 92.41,55.25 R31.1
SIN56_J11
  Top 0.152: J11.10 57.15,61.95 57.15,59 59.31,56.84 84.89,56.84 86.61,55.12 R29.1
SIN56_J12
  Top 0.152: J12.10 40.13,61.96 40.13,58.88 44.2,54.81 78.16,54.81 R27.1
SIN56_J13
  Top 0.152: J13.10 23.11,61.98 23.11,59.16 31.5,50.77 54.71,50.77 55.19,50.29 R25.1
SIN56_J14
  Top 0.152: J14.10 6.1,61.98 6.1,57.91 16.38,47.7 50.55,47.7 52.22,45.95 60.65,45.95 61.72,44.88 72.44,44.88 R23.1
SIN78_J3
  Top 0.152: J3.9 194.63,56.58 151.89,13.84 114.68,13.84 R6.1
SIN78_J4
  Top 0.152: J4.9 177.6,53.65 143.38,19.43 110.11,19.43 R9.1
SIN78_J5
  Top 0.152: J5.9 160.66,60.57 160.66,45.72 140.59,25.65 106.17,25.65 R13.1
SIN78_J6
  Top 0.152: J6.9 143.54,59.31 147.96,54.89 147.96,41.91 138.05,32 99.82,32 R17.1
SIN78_J7
  Top 0.152: J7.9 126.51,56.91 124.59,54.99 116.48,54.99 R55.2
SIN78_J8
  Top 0.152: J8.9 109.48,57.15 109.48,56.9 109.48,56.59 R53.2
SIN78_J9
  Top 0.152: J9.9 92.45,60.27 94.05,58.67 97.79,58.67 99.62,56.84 R51.2
SIN78_J10
  Top 0.152: J10.9 75.42,59.84 75.87,59.38 89.59,59.38 93.98,54.99 R49.2
SIN78_J11
  Top 0.152: J11.9 58.39,59.29 60.32,57.35 85.78,57.35 88.06,55.07 R47.2
SIN78_J12
  Top 0.152: J12.9 41.36,59.43 45.47,55.32 80.06,55.32 R45.2
SIN78_J13
  Top 0.152: J13.9 24.33,59.51 32.27,51.56 R43.2
SIN78_J14
  Top 0.152: J14.9 7.3,59.61 18.5,48.46 51.56,48.46 53.03,46.94 61.36,46.94 62.3,46 71.53,46 R41.2
VSYNC
  Top 0.152: J2.33 22.32,17.88 35.69,31.24 FPGA.96

### Text on the board
tPlace: shared standoff / (mount + hdmi) | SIN | SIN | SIN | SIN | SIN | SIN | SIN | SIN | SIN | SIN | SIN | SIN | R22-R56 (50Ω) | R6-R21 (50Ω)
bPlace: 24V | ENCODER | ENCODER0 | JP2 GPIO1 | JP3 | 5V (FPGA) | JP1 / GPIO0
tDocu: Voxel / Control Board / v2